# EAGLE design MiniServo Master (EAGLE 7.2.0)
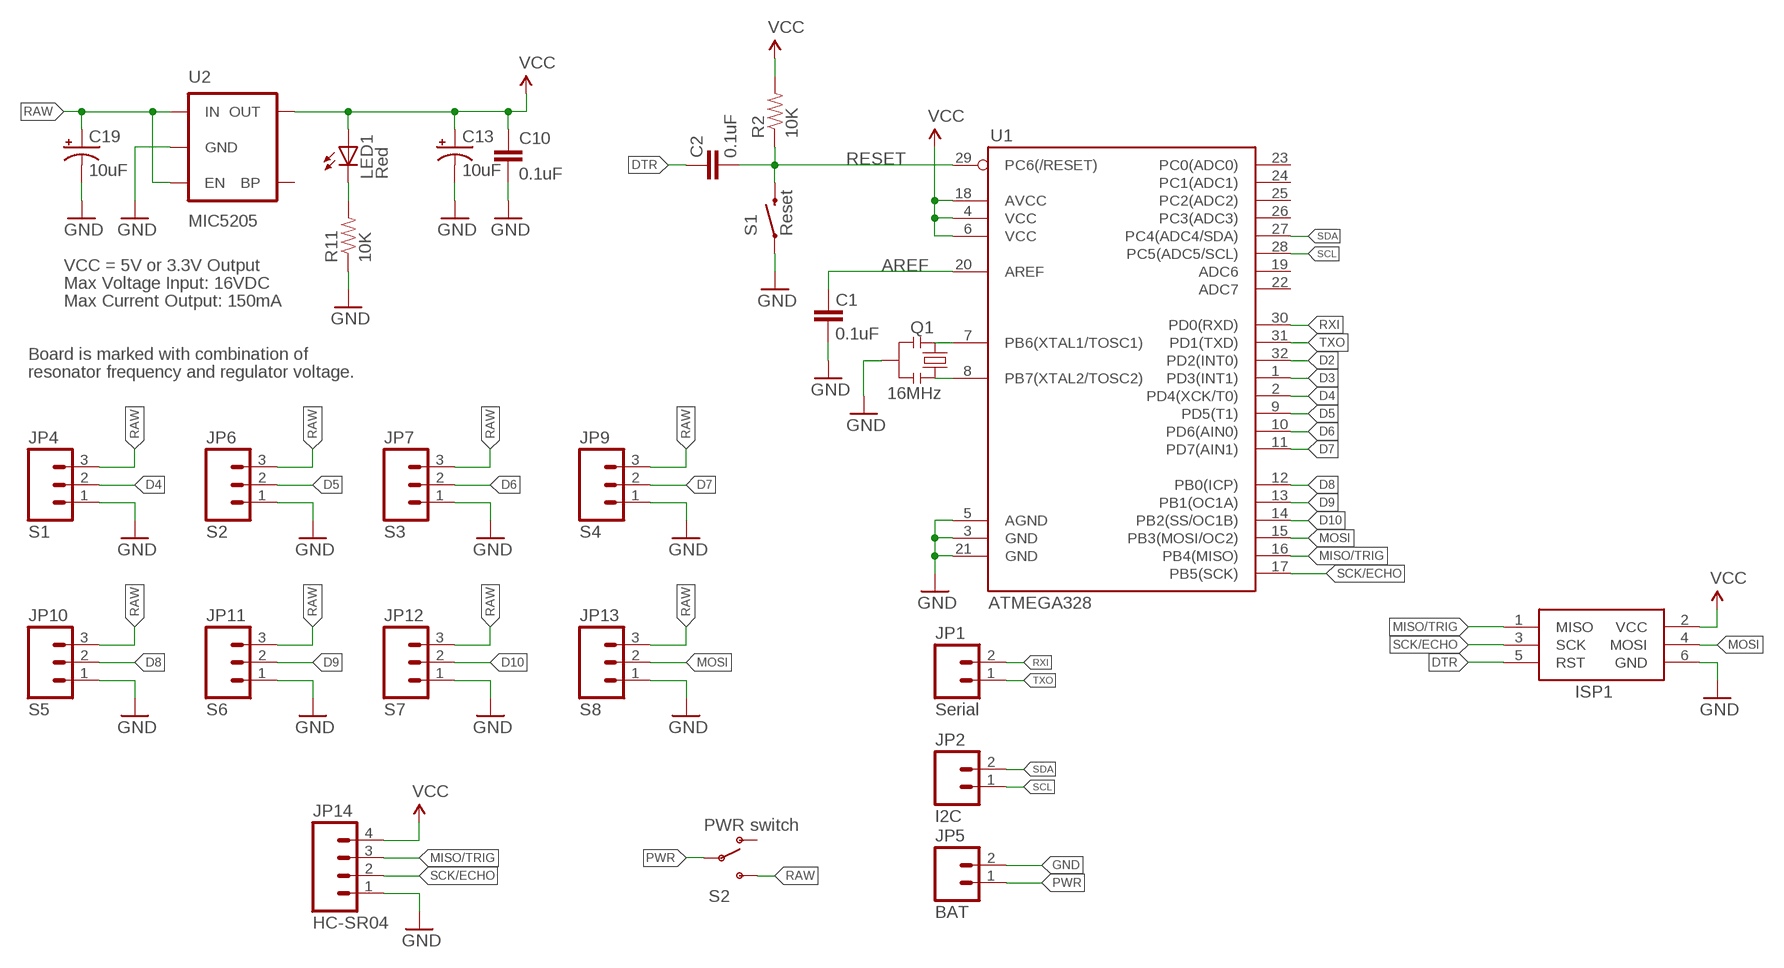
[diagram p0: schematic, sheet 1]

## Parts
C1  0.1uF  CAP0603-CAP  [0603-CAP]
C2  0.1uF  CAP0603-CAP  [0603-CAP]
C10  0.1uF  CAP0603-CAP  [0603-CAP]
C13  10uF  CAP_POL1206  [EIA3216]
C19  10uF  CAP_POL1206  [EIA3216]
ISP1  AVRISP-6  [AVRISP]
JP1  Serial  M021X02_NO_SILK  [1X02_NO_SILK]
JP2  I2C  M021X02_NO_SILK  [1X02_NO_SILK]
JP4  S1  M031X03_NO_SILK  [1X03_NO_SILK]
JP5  BAT  M021X02_NO_SILK  [1X02_NO_SILK]
JP6  S2  M031X03_NO_SILK  [1X03_NO_SILK]
JP7  S3  M031X03_NO_SILK  [1X03_NO_SILK]
JP9  S4  M031X03_NO_SILK  [1X03_NO_SILK]
JP10  S5  M031X03_NO_SILK  [1X03_NO_SILK]
JP11  S6  M031X03_NO_SILK  [1X03_NO_SILK]
JP12  S7  M031X03_NO_SILK  [1X03_NO_SILK]
JP13  S8  M031X03_NO_SILK  [1X03_NO_SILK]
JP14  HC-SR04  M041X04_NO_SILK  [1X04_NO_SILK]
LED1  Red  LED  [0603-LED-ALT1]
Q1  16MHz  RESONATOR1:1  [RESONATOR-SMD-1:1]
R2  10K  RESISTOR0603-RES  [0603-RES]
R11  10K  RESISTOR0603-RES  [0603-RES]
S1  Reset  SWITCH-MOMENTARY-2SMD-ALT01  [TACTILE-SWITCH-SMD-ALT01]
S2  PWR switch  SWITCH-SPDT-SMD-A  [SWITCH-SPST-SMD-A]
U1  ATMEGA328  ATMEGA168  [TQFP32-08]
U2  MIC5205  V_REG_LDOSMD  [SOT23-5]

## Nets
3.3V: ISP1.2(VCC) JP14.4 ; supply symbol labelled VCC
AREF: C1.2 U1.20(AREF)
D2: U1.32(PD2(INT0))
D3: U1.1(PD3(INT1))
D4: JP4.2 U1.2(PD4(XCK/T0))
D5: JP6.2 U1.9(PD5(T1))
D6: JP7.2 U1.10(PD6(AIN0))
D7: JP9.2 U1.11(PD7(AIN1))
D8: JP10.2 U1.12(PB0(ICP))
D9: JP11.2 U1.13(PB1(OC1A))
D10: JP12.2 U1.14(PB2(SS/OC1B))
DTR: C2.2 ISP1.5(RST)
GND [vcc]: C1.1 C10.2 C13.C(-) C19.C(-) ISP1.6(GND) JP4.1 JP5.2 JP6.1 JP7.1 JP9.1 JP10.1 JP11.1 JP12.1 JP13.1 JP14.1 Q1.2 R11.1 S1.1 S1.2 U1.3(GND) U1.5(AGND) U1.21(GND) U2.2(GND)
MISO/TRIG: ISP1.1(MISO) JP14.3 U1.16(PB4(MISO))
MOSI: ISP1.4(MOSI) JP13.2 U1.15(PB3(MOSI/OC2))
N$1: Q1.3 U1.8(PB7(XTAL2/TOSC2))
N$2: Q1.1 U1.7(PB6(XTAL1/TOSC1))
N$4: LED1.C R11.2
PWR: JP5.1 S2.2(P)
RAW [vcc]: C19.A(+) JP4.3 JP6.3 JP7.3 JP9.3 JP10.3 JP11.3 JP12.3 JP13.3 S2.3(S) U2.1(IN) U2.3(EN)
RESET: C2.1 R2.1 S1.3 S1.4 U1.29(PC6(/RESET))
RXI: JP1.2 U1.30(PD0(RXD))
SCK/ECHO: ISP1.3(SCK) JP14.2 U1.17(PB5(SCK))
SCL: JP2.1 U1.28(PC5(ADC5/SCL))
SDA: JP2.2 U1.27(PC4(ADC4/SDA))
TXO: JP1.1 U1.31(PD1(TXD))
VCC: C10.1 C13.A(+) LED1.A R2.2 U1.4(VCC) U1.6(VCC) U1.18(AVCC) U2.5(OUT)
Unconnected: S2.1(O) U1.19(ADC6) U1.22(ADC7) U1.23(PC0(ADC0)) U1.24(PC1(ADC1)) U1.25(PC2(ADC2)) U1.26(PC3(ADC3)) U2.4(BP)

## Notes on the sheet
- VCC = 5V or 3.3V Output
- Max Voltage Input: 16VDC
- Max Current Output: 150mA
- Board is marked with combination of
- resonator frequency and regulator voltage.

## Library data of the parts
C1 C2 C10 = SparkFun:CAP: Capacitor Standard 0603 ceramic capacitor, and 0.1" leaded capacitor.
C13 C19 = SparkFun:CAP_POL: Capacitor Polarized These are standard SMD and PTH capacitors. Normally 10uF, 47uF, and 100uF in electrolytic and tantalum varieties. Always verify the external diameter of the through hole cap, it varies with capacity, voltage, and manufacturer. The EIA devices should be standard.
ISP1 = adafruit:AVRISP: AVR ISP HEADER Standard 6 pin header for AVR programming
JP1 JP2 JP5 = SparkFun-Connectors:M02: Standard 2-pin 0.1" header. Use with - straight break away headers ( PRT-00116) - right angle break away headers (PRT-00553) - swiss pins (PRT-00743) - machine pins (PRT-00117) - female headers (PRT-00115) Molex polarized connector foot print use with: PRT-08233 with associated crimp pins and housings. 2.54_SCREWTERM for use with PRT-10571. 3.5mm Screw Terminal footprints for PRT-08084 5mm Screw Terminal footprints for use with PRT-08433
JP4 JP6 JP7 JP9-JP13 = SparkFun-Connectors:M03: Header 3 Standard 3-pin 0.1" header. Use with straight break away headers (SKU : PRT-00116), right angle break away headers (PRT-00553), swiss pins (PRT-00743), machine pins (PRT-00117), and female headers (PRT-00115). Molex polarized connector foot print use with SKU : PRT-08232 with associated crimp pins and housings.
JP14 = SparkFun-Connectors:M04: Header 4 Standard 4-pin 0.1" header. Use with straight break away headers (SKU : PRT-00116), right angle break away headers (PRT-00553), swiss pins (PRT-00743), machine pins (PRT-00117), and female headers (PRT-00115). Molex polarized connector foot print use with SKU : PRT-08231 with associated crimp pins and housings. 1MM SMD Version SKU: PRT-10208
LED1 = Testing:LED: LEDs Standard schematic elements and footprints for 5mm, 3mm, 1206, and 0603 sized LEDs. 5mm - Spark Fun Electronics SKU : COM-00529 (and others)
Q1 = Testing:RESONATOR: Resonator Small SMD resonator. This is the itty bitty 10/20MHz resonators with built in caps. CSTCE10M0G55 and CSTCE20M0V53. Footprint for SMD has been used in SFE production for years, and does work okay. 1:1 is an attempt to get larger fillets on the sides so it will be easier to inspect these solders in our AOI machine. The pads have been minimized to match the actual metal under the resonator. To see this relation, it includes an image import of the bottom side of the component. Imported to scale on layer 200.
R2 R11 = SparkFun:RESISTOR: Resistor Basic schematic elements and footprints for 0603, 1206, and PTH resistors.
S1 = Testing:SWITCH-MOMENTARY-2: Various NO switches- pushbuttons, reed, etc
S2 = SparkFun-Electromechanical:SWITCH-SPDT: SPDT Switch Simple slide switch, Spark Fun Electronics SKU : COM-00102 DPDT SMT slide switch, AYZ0202, SWCH-08179
U1 = SparkFun:ATMEGA168
U2 = SparkFun:V_REG_LDO: Voltage Regulator LDO Standard 150mA LDO voltage regulator in SOT-23 layout. Micrel part MIC5205. BP (by-pass) pin is used to lower output noise with 470pF cap.

## Net classes
0 default: width 0.203 mm
1 vcc: width 0.254 mm

## Board
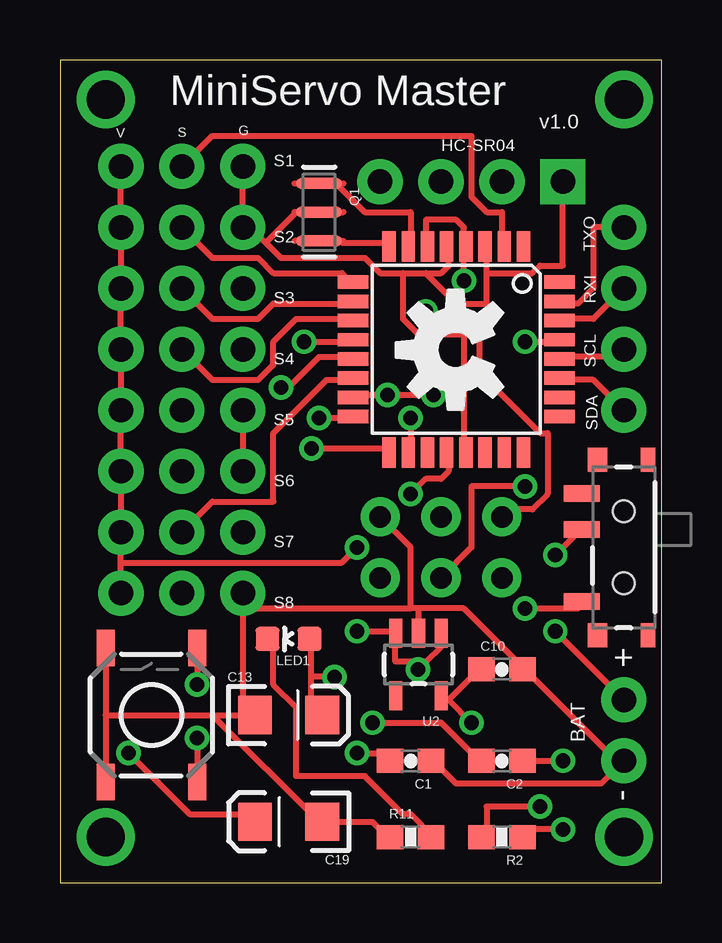
[diagram p1: board, top side]
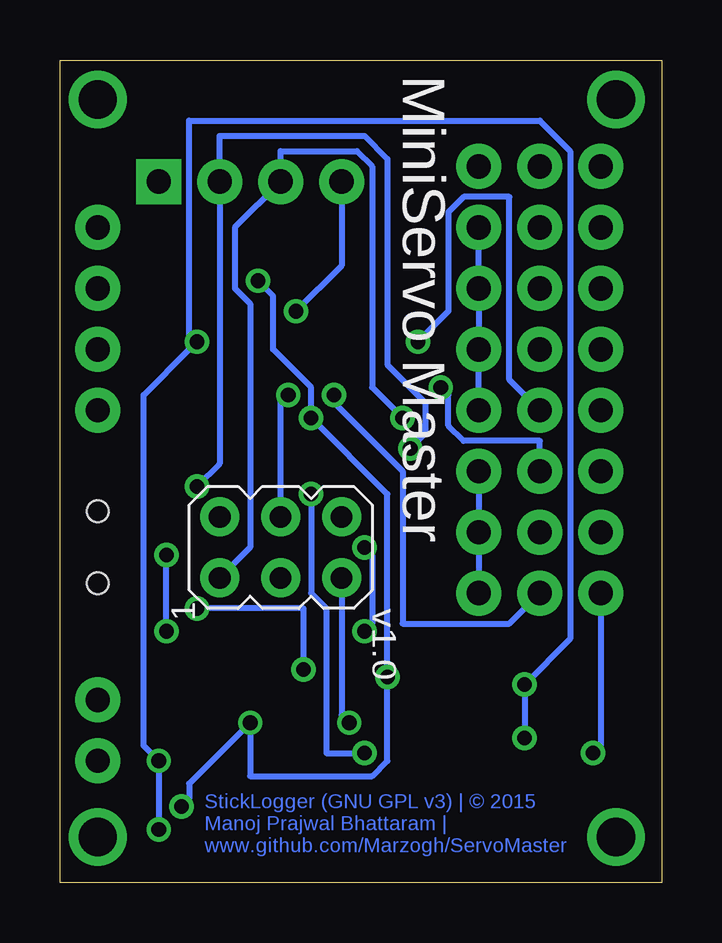
[diagram p2: board, bottom side, seen from below]

Size 25.07 x 34.28 mm. Coordinates in mm from the lower left corner, seen from the top.
Outline: 0,0 25.07,0 25.07,34.28 0,34.28 0,0
Copper layers (1*16): Top 0.035mm / dielectric 1.5mm / Bottom 0.035mm
Design rules "default": minimum track width 10mil, minimum drill 24mil, track to track 8mil, track to pad 8mil, pad to pad 8mil, via to via 8mil, smd to smd 8mil, copper to edge 40mil, drill to drill 8mil, minimum pad ring 10mil, minimum via ring 8mil, stop-mask expansion 4mil, vias tented up to drill 0mil, thermal gap 10mil

### Footprints (pad centres in the part's own frame; a part is rotated, then mirrored left to right if it is on the bottom)
0603-CAP = smd 1.1 x 1: 1 -0.85,0; 2 0.85,0
EIA3216 = smd 1.4 x 1.6: A 1.4,0; C -1.4,0
AVRISP = drill 0.9 pad 1.626: 1 -1.27,2.54; 2 1.27,2.54; 3 -1.27,0; 4 1.27,0; 5 -1.27,-2.54; 6 1.27,-2.54
1X02_NO_SILK = drill 1.016 pad 1.88: 1 0,0; 2 2.54,0
1X03_NO_SILK = drill 1.016 pad 1.88: 1 0,0; 2 2.54,0; 3 5.08,0
1X04_NO_SILK = drill 1.016 pad 1.88 square: 1 0,0 | drill 1.016 pad 1.88: 2 2.54,0; 3 5.08,0; 4 7.62,0
0603-LED-ALT1 = smd 1 x 1: A 0,-0.877; C 0,0.877
RESONATOR-SMD-1:1 = smd 0.45 x 1.905: 1 -1.2,0; 2 0,0; 3 1.2,0
0603-RES = smd 1.1 x 1: 1 -0.85,0; 2 0.85,0
TACTILE-SWITCH-SMD-ALT01 = smd 1.524 x 0.762: 1 -2.794,1.905; 2 2.794,1.905; 3 -2.794,-1.905; 4 2.794,-1.905
SWITCH-SPST-SMD-A = smd 0.7 x 1.5: 1 -2.25,-1.75; 2 -0.75,-1.75; 3 2.25,-1.75 | smd 1 x 0.6: GND1 -3.65,1; GND3 3.65,1 | smd 1 x 0.8: GND2 -3.65,-1.1; GND4 3.65,-1.1 | hole 0.9: -1.5,0; 1.5,0
TQFP32-08 = smd 1.27 x 0.559: 1 -4.293,2.8; 2 -4.293,2; 3 -4.293,1.2; 4 -4.293,0.4; 5 -4.293,-0.4; 6 -4.293,-1.2; 7 -4.293,-2; 8 -4.293,-2.8; 17 4.293,-2.8; 18 4.293,-2; 19 4.293,-1.2; 20 4.293,-0.4; 21 4.293,0.4; 22 4.293,1.2; 23 4.293,2; 24 4.293,2.8 | smd 0.559 x 1.27: 9 -2.8,-4.293; 10 -2,-4.293; 11 -1.2,-4.293; 12 -0.4,-4.293; 13 0.4,-4.293; 14 1.2,-4.293; 15 2,-4.293; 16 2.8,-4.293; 25 2.8,4.293; 26 2,4.293; 27 1.2,4.293; 28 0.4,4.293; 29 -0.4,4.293; 30 -1.2,4.293; 31 -2,4.293; 32 -2.8,4.293
SOT23-5 = smd 0.55 x 1.2: 1 -0.95,-1.3; 2 0,-1.3; 3 0.95,-1.3; 4 0.95,1.3; 5 -0.95,1.3

### Placement (x,y rotation side)
C1  14.61,5.08 180 top
C2  18.41,5.08 180 top
C10  18.41,8.89 0 top
C13  9.53,6.99 0 top
C19  9.53,2.54 180 top
ISP1  15.88,13.97 90 bottom
JP1  23.5,27.3 270 top
JP2  23.5,22.23 270 top
JP4  7.62,29.84 0 bottom
JP5  23.5,7.62 270 top
JP6  7.62,27.3 0 bottom
JP7  7.62,24.77 0 bottom
JP9  7.62,22.23 0 bottom
JP10  7.62,19.68 0 bottom
JP11  7.62,17.14 0 bottom
JP12  7.62,14.61 0 bottom
JP13  7.62,12.06 0 bottom
JP14  20.95,29.21 0 bottom
LED1  9.53,10.16 90 top
Q1  10.79,27.94 270 top
R2  18.41,1.91 180 top
R11  14.61,1.91 0 top
S1  3.81,6.99 90 top
S2  23.5,13.97 270 top
U1  16.51,22.23 270 top
U2  14.94,9.09 180 top
U$1  [OSHW-LOGO-M]  16.48,22.2 90 top

### Tracks (layer width: path | path; a pad name or v marks a point on that pad's centre or on a via)
3.3V  (via drill 0.61)
  Top 0.254: ISP1.2 18.73,15.56 19.68,15.56 20.32,16.19 20.32,18.73 20,18.73 17.46,21.27 17.46,23.5 15.56,23.5 v15.24,23.81
  Bottom 0.254: v15.24,23.81 13.34,25.72 JP14.4
AREF  (via drill 0.61)
  Top 0.254: v12.38,5.4 13.34,5.4 13.65,5.08 C1.2 | v14.61,16.19 15.24,16.83 15.88,16.83 16.19,17.14 16.19,17.78 U1.20
  Bottom 0.254: v12.38,5.4 13.97,5.4 13.97,11.43 14.61,12.06 v14.61,16.19
D4
  Top 0.254: JP4.2 6.35,31.11 17.14,31.11 17.14,28.57 17.78,27.94 18.41,27.94 18.41,26.67 U1.2
D5
  Top 0.254: JP6.2 6.35,26.04 8.26,26.04 8.89,25.4 11.75,25.4 12.06,25.08 U1.9
D6
  Top 0.254: JP7.2 6.35,23.5 8.26,23.5 8.89,24.13 12.06,24.13 U1.10
D7
  Top 0.254: JP9.2 6.35,20.95 8.26,20.95 8.89,21.59 8.89,22.54 9.84,23.5 12.06,23.5 U1.11
D8  (via drill 0.61)
  Top 0.254: v10.16,22.54 12.06,22.54 U1.12
  Bottom 0.254: v10.16,22.54 8.89,23.81 8.89,27.94 8.26,28.57 6.35,28.57 6.35,20.95 JP10.2
D9  (via drill 0.61)
  Top 0.254: v9.21,20.64 9.53,20.64 10.79,21.91 12.06,21.91 U1.13
  Bottom 0.254: v9.21,20.64 8.89,20.32 8.89,19.05 8.26,18.41 5.08,18.41 JP11.2
D10
  Top 0.254: JP12.2 6.35,15.88 8.89,15.88 8.89,18.73 11.11,20.95 12.06,20.95 U1.14
DTR  (via drill 0.61)
  Top 0.254: v13.02,6.67 15.88,6.67 17.46,5.08 C2.2
  Bottom 0.254: v13.02,6.67 13.34,6.99 ISP1.5
GND
  Top 0.254: 14.29,25.4 13.34,25.4 12.7,26.04 9.21,26.04 8.57,26.67 | 14.29,25.4 15.24,25.4 | 15.24,25.4 15.88,25.4 16.19,25.72 16.19,26.35 U1.5 | 8.57,26.67 7.94,27.3 JP6.1 JP4.1 | 14.29,25.4 14.29,23.5 14.92,22.86 16.83,22.86 16.83,18.1 U1.21 | 17.78,25.4 17.78,24.13 16.51,24.13 15.24,25.4 | 17.78,25.4 17.78,26.35 U1.3 | 8.57,26.67 9.84,27.94 9.78,27.94 | JP14.1 20.95,25.72 20,25.72 19.68,25.4 17.78,25.4 | C1.1 15.56,5.08 16.51,4.13 22.54,4.13 JP5.2 23.18,5.08 19.37,8.89 | 14.92,11.43 14.92,10.48 U2.2 | 14.92,11.43 16.83,11.43 19.37,8.89 | 19.37,8.89 C10.2 | ISP1.6 14.61,13.97 14.61,11.43 | 14.92,11.43 14.61,11.43 | R11.1 13.65,1.91 13.02,2.54 C19.C 10.79,2.54 6.35,6.99 | S1.2 1.91,6.99 | 1.91,6.99 S1.1 | 1.91,6.99 6.35,6.99 | 6.35,6.99 7.62,6.99 | 7.62,6.99 C13.C 7.94,6.99 | JP10.1 JP11.1 | 7.62,11.43 7.62,6.99 | 7.62,11.43 14.61,11.43 | 7.62,11.43 JP13.1
  Bottom 0.254: JP13.1 JP12.1 JP11.1 | JP10.1 JP9.1 JP7.1 JP6.1
MISO/TRIG  (via drill 0.61)
  Top 0.254: v10.79,19.37 12.06,19.37 U1.16
  Bottom 0.254: v10.79,19.37 12.06,20.64 12.06,29.84 12.7,30.48 15.88,30.48 JP14.3 17.78,27.3 17.78,24.77 17.14,24.13 17.14,13.97 ISP1.1
MOSI  (via drill 0.61)
  Top 0.254: v15.56,20.32 v13.65,20.32 12.38,20.32 U1.15
  Bottom 0.254: v15.56,20.32 15.88,20 ISP1.4 | JP13.2 6.35,10.79 10.79,10.79 10.79,17.14 13.65,20 v13.65,20.32
N$1
  Top 0.254: U1.8 13.65,26.67 11.75,26.67 Q1.3
N$2
  Top 0.254: U1.7 14.61,26.67 14.61,27.94 12.7,27.94 11.43,29.21 Q1.1
N$3  (via drill 1.6)
  other vias: 23.5,1.91
N$4
  Top 0.254: LED1.C 8.89,10.16 8.89,8.26 9.84,7.3 9.84,4.45 12.7,4.45 14.29,2.86 14.61,2.86 15.56,1.91 R11.2
N$5  (via drill 1.6)
  other vias: 1.91,1.91
N$6  (via drill 1.6)
  other vias: 23.5,32.64
N$7  (via drill 1.6)
  other vias: 1.91,32.64
PWR  (via drill 0.61)
  Top 0.254: v20.64,13.65 21.59,14.61 S2.2 | JP5.1 v20.64,10.48
  Bottom 0.254: v20.64,10.48 v20.64,13.65
RAW  (via drill 0.61)
  Top 0.254: JP4.3 JP6.3 JP7.3 JP9.3 JP10.3 JP11.3 JP12.3 2.54,13.34 | 14.92,9.21 15.24,9.21 15.88,9.84 15.88,10.16 U2.1 | 14.92,9.21 13.97,9.21 13.97,10.16 U2.3 13.97,10.48 v12.38,10.48 | v19.37,11.43 21.59,11.43 S2.3 | 14.92,9.21 v14.92,8.89 | v2.86,5.4 5.4,2.86 7.62,2.86 7.94,2.54 C19.A | JP13.3 2.54,13.34 | v12.38,13.97 11.75,13.34 2.54,13.34
  Bottom 0.254: v19.37,11.43 14.92,11.43 v14.92,8.89 | v2.86,5.4 2.54,5.71 JP13.3 | v12.38,10.48 12.06,10.79 12.06,13.65 v12.38,13.97
RESET  (via drill 0.61)
  Top 0.254: v5.71,6.03 S1.3 | S1.4 v5.71,8.26 | v20.95,2.22 19.68,2.22 19.37,1.91 R2.1 | C2.1 v20.95,5.08 | v19.37,22.54 20.64,22.54 U1.29
  Bottom 0.254: v5.71,6.03 v5.71,8.26 3.81,10.16 3.81,30.48 5.08,31.75 19.68,31.75 19.68,22.23 | v20.95,2.22 v20.95,5.08 21.59,5.71 21.59,20.32 19.68,22.23 | 19.68,22.23 v19.37,22.54
RXI
  Top 0.254: JP1.2 22.23,23.5 20.95,23.5 U1.30
SCK/ECHO  (via drill 0.61)
  Top 0.254: v10.48,18.1 13.65,18.1 U1.17 | ISP1.3 17.14,13.97 17.14,16.51 v19.37,16.51
  Bottom 0.254: v10.48,18.1 9.84,18.73 9.84,20 11.43,21.59 11.43,30.16 12.38,31.11 18.41,31.11 JP14.2 18.41,17.46 v19.37,16.51
SCL
  Top 0.254: JP2.1 23.18,21.91 20.95,21.91 U1.28
SDA
  Top 0.254: JP2.2 22.23,20.95 20.95,20.95 U1.27
TXO
  Top 0.254: JP1.1 22.23,27.3 22.23,24.77 21.59,24.13 20.95,24.13 U1.31
VCC  (via drill 0.61)
  Top 0.254: 10.48,8.57 10.48,6.99 C13.A | 10.48,8.57 10.48,10.16 LED1.A | U1.6 15.24,26.67 15.24,27.62 16.51,27.62 16.83,27.3 16.83,26.67 U1.4 16.83,26.35 v16.83,25.08 | v20,3.17 17.78,3.17 17.78,1.91 R2.2 | 16.19,7.62 v17.14,6.67 | 16.19,7.62 15.88,7.62 U2.5 | 16.19,7.62 17.46,8.89 C10.1 | v14.61,19.37 14.61,18.1 U1.18 | v11.43,8.57 10.48,8.57
  Bottom 0.254: v20,3.17 19.68,3.49 19.68,4.13 v17.14,6.67 17.14,4.45 12.06,4.45 11.43,5.08 v11.43,8.57 11.43,16.19 v14.61,19.37 14.61,20.64 16.19,22.23 16.19,24.45 v16.83,25.08

### Text on the board
Bottom: StickLogger (GNU GPL v3) | © 2015 / Manoj Prajwal Bhattaram | / www.github.com/Marzogh/ServoMaster
_tsilk: MiniServo Master | V | S | G | v1.0 | TXO | RXI | SCL | SDA | + | BAT | -
_bsilk: MiniServo Master | v1.0